# Altium schematic sheet Power_Supply.SchDoc: Power Supply
size A4; Author: Robin Geißler; CompanyName: Fraunhofer EMFT; DrawnBy: Robin Geißler; Revision: 1.0.; SheetNumber: 2; SheetTotal: 6
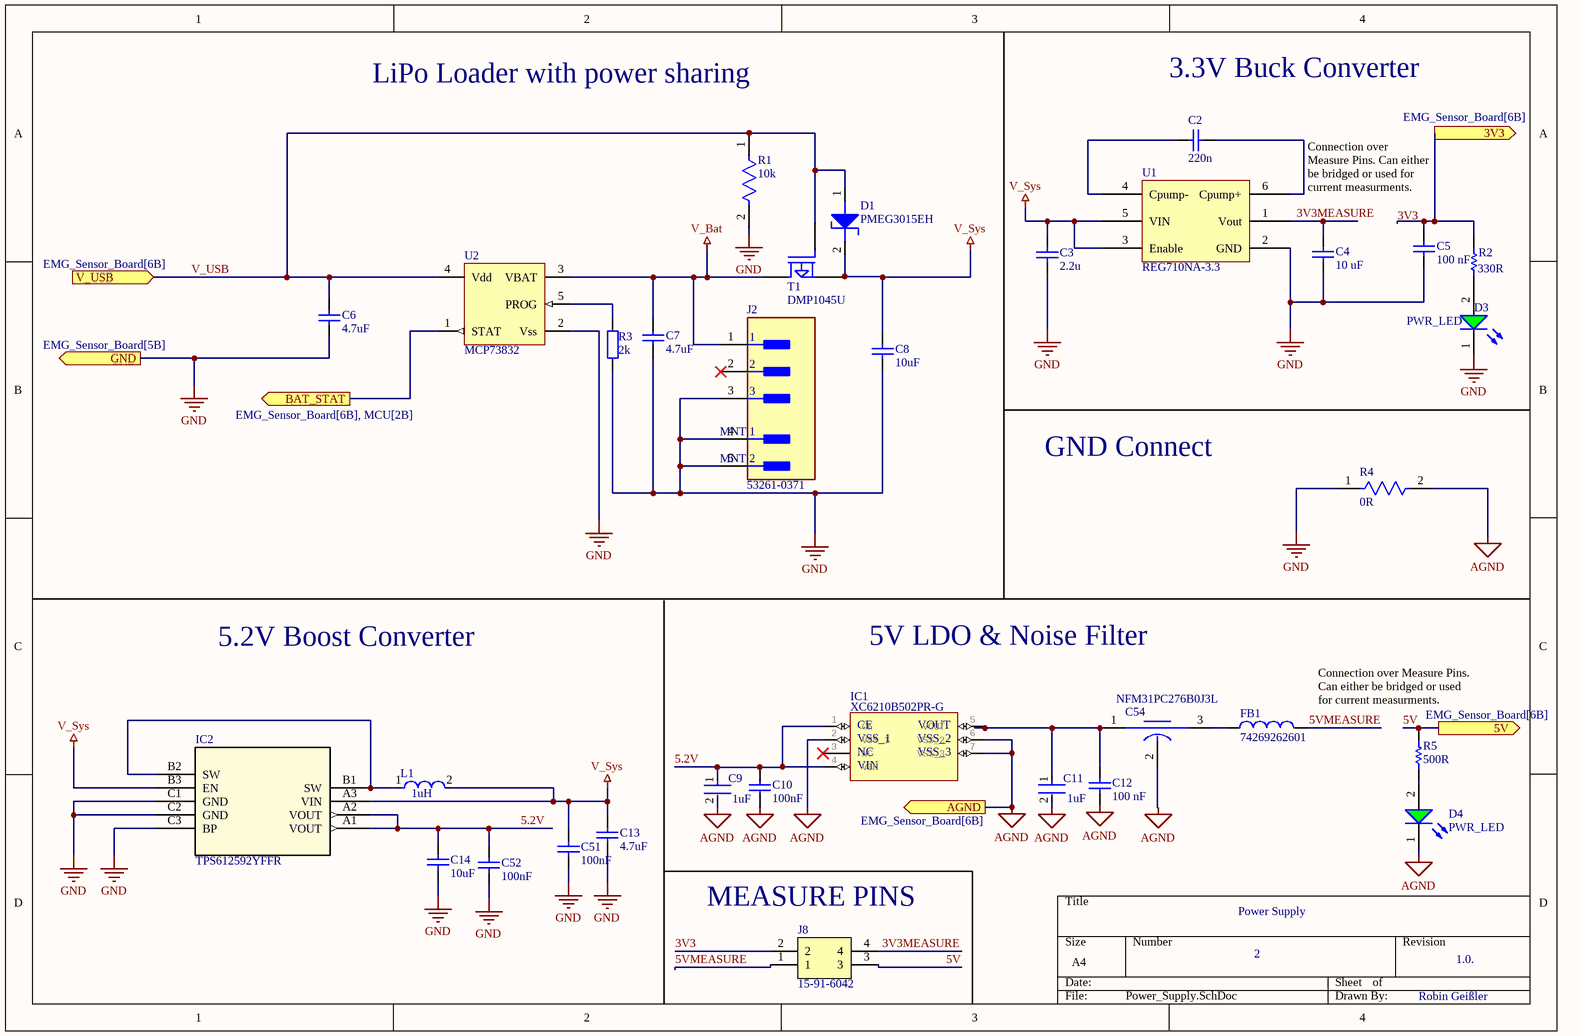
[diagram p0: Power_Supply.SchDoc]

## Parts
C2  220n  [C-1608 [0603]-N]
C3  2.2u  [C-1608 [0603]-N]
C4  10 uF  [C-1608 [0603]-N]
C5  100 nF  [C-1608 [0603]-N]
C6  4.7uF  [C-1608 [0603]-N]
C7  4.7uF  [C-1608 [0603]-N]
C8  10uF  [C-1608 [0603]-N]
C9  1uF  [FP-CGA3E-0_3-0_1-IPC_B]
C10  100nF  [C-1608 [0603]-N]
C11  1uF  [FP-CGA3E-0_3-0_1-MFG]
C12  100 nF  [C-1608 [0603]-N]
C13  4.7uF  [C-1608 [0603]-N]
C14  10uF  [C-1608 [0603]-N]
C51  100nF  [C-1608 [0603]-N]
C52  100nF  [C-1608 [0603]-N]
C54  NFM31PC276B0J3L  [FP-NFM31-0_2-MFG]
D1  PMEG3015EH  [SOD-123-D]
D3  PWR_LED  [WL-SMCW_0603_150060xx75000]
D4  PWR_LED  [WL-SMCW_0603_150060xx75000]
FB1  74269262601  [WE-TMSB_0603_HC]
IC1  XC6210B502PR-G  [XC6210B502PRG]
IC2  TPS612592YFFR  [DSBGA09_1P206X1P306_TEX]
J2  53261-0371  [FP-53261-0371-MFG]
J8  15-91-6042  [15916042]
L1  1uH  [FP-IHLP-1616BZ-FP_1_8545x-MFG]
R1  10k  [FP-RC0603-0_55-IPC_C]
R2  330R  [RESC1608X55X30LL15T15]
R3  2k  [C-1608 [0603]-N]
R4  0R  [FP-CRCW0603-e3-IPC_B]
R5  500R  [RESC1608X55X30NL15T15]
T1  DMP1045U  [SOT-23-3-PMOS]
U1  REG710NA-3.3  [SOT-23/6]
U2  MCP73832  [SOT95P280X145-5N]

## Ports
3V3 (out, see EMG_Sensor_Board[6B]), 5V (out, see EMG_Sensor_Board[6B]), AGND (out, see EMG_Sensor_Board[6B]), BAT_STAT (out, see EMG_Sensor_Board[6B], MCU[2B]), GND (out, see EMG_Sensor_Board[5B]), V_USB (in, see EMG_Sensor_Board[6B])

## Nets
AGND: C9.2 C10.2 C11.2 C12.2 C54.2(GND) D4.1(K) IC1.2(VSS_1) IC1.6(VSS_2) IC1.7(VSS_3) R4.2 ; port AGND
GND: C3.1 C4.1 C5.2 C6.1 C7.1 C8.1 C13.1 C14.1 C51.2 C52.2 D3.1(K) IC2.C1(GND) IC2.C2(GND) IC2.C3(BP) J2.3 J2.4(MNT_1) J2.5(MNT_2) R1.2 R3.1 R4.1 U1.2(GND) U2.2(Vss) ; port GND
V_Bat: C7.2 J2.1 T1.2(D) U2.3(VBAT)
V_Sys: C3.2 C8.2 C13.2 C51.1 D1.2 IC2.A3(VIN) IC2.B3(EN) L1.2 T1.3(S) U1.3(Enable) U1.5(VIN)
3V3: C5.1 J8.2 R2.2 ; port 3V3
3V3MEASURE: C4.2 J8.4 U1.1(Vout)
5.2V: C9.1 C10.1 C14.2 C52.1 IC1.1(CE) IC1.4(VIN) IC2.A1(VOUT) IC2.A2(VOUT)
5V: J8.3 R5.2 ; port 5V
5VMEASURE: FB1.2 J8.1
BAT_STAT: U2.1(STAT) ; port BAT_STAT
V_USB: C6.2 D1.1 R1.1 T1.1(G) U2.4(Vdd) ; port V_USB
NetC2_1: C2.1 U1.4(Cpump-)
NetC2_2: C2.2 U1.6(Cpump+)
NetC11_1: C11.1 C12.1 C54.1(Input) IC1.5(VOUT)
NetC54_3: C54.3(Output) FB1.1
NetD3_2: D3.2(A) R2.1
NetD4_2: D4.2(A) R5.1
NetIC2_B1: IC2.B1(SW) IC2.B2(SW) L1.1
NetR3_2: R3.2 U2.5(PROG)

Not connected (* = marked no-connect by the designer): IC1 3(NC)*; J2 2*

## Notes on the sheet
- LiPo Loader with power sharing
- 3.3V Buck Converter
- Connection over Measure Pins. Can either be bridged or used for current measurments.
- GND Connect
- 5.2V Boost Converter
- 5V LDO & Noise Filter
- (near J8) MEASURE PINS

## Library data of the parts
C2 = C220n_0603_CGA3E3X7R1H224K080AB: CAP 0603 50V 0.22uF X7R 10% AEC-Q200; Supplier 1: Mouser; Supplier Part Number 1: 810-CGA3E3X7R1H224K
C3 = C2u2_0603_GRM188R61E225KA12D: CAP 0603 2.2uF 25volts X5R 10%; Supplier 1: Mouser; Supplier Part Number 1: 81-GRM188R61E225KA2D
C4 C8 C14 = C10u_0603_GRM188R61E106KA73J: CAP CER 10UF 25V X5R 0603 10%; Supplier 1: Mouser; Supplier Part Number 1: 81-GRM188R61E106KA3J
C5 C12 = C100n_0603_C0603C104J4RAC: Multilayer Ceramic Capacitors MLCC - SMD/SMT 16volts 0.1uF 5% X7R; Manufacturer: KEMET; Capacitance: 100nF; Voltage Rating: 16V; Dissipation Factor: 3.5%; Supplier 1: Mouser; Supplier Part Number 1: 80-C0603C104J4RAC; Manufacturer Part Number: C0603C104J4RAC; Description 1: Multilayer Ceramic Capacitors MLCC - SMD/SMT 16volts 0.1uF 5% X7R; Stock 1: 0; Pricing 1: 1=0.14, 10=0.055, 50=0.055, 100=0.038, 1000=0.026, 10000=0.018 (USD); Case/Package: 0603; Case Code (Imperial): 0603; Case Code (Metric): 1608; Dielectric Material: Ceramic; Min Operating Temperature: -55°C; Max Operating Temperature: 125°C; Tolerance: 5%; Packaging: Tape and Reel; Dielectric: X7R; Termination: SMD/SMT; Package Quantity: 4000; Voltage Rating (DC): 16V; Length: 1.6mm; Height: 0.8mm; Width: 0.8mm
C6 C7 C13 = C4u7_0603_C1608X5R1C475K080AE: CAP CER 0603 16V 4.70uF X5R 10%; Supplier 1: Mouser; Supplier Part Number 1: 810-C1608X5R1C475KE
C9 C11 = CMP-08246-002551-1: Cap Ceramic 1uF 35V X7R 10% Pad SMD 0603 +125°C Automotive T/R; Termination: SMD/SMT; Packaging: Tape and Reel; Capacitance: 1uF; Tolerance: 10%; Mount: Surface Mount; Thickness: 0.035inch; Case Code (Imperial): 0603; Voltage Rating: 35V; Case/Package: 0603; Case Code (Metric): 1608; Dielectric: X7R; Width: 0.031inch; Length: 0.063inch; Min Operating Temperature: -55°C; Weight: 7.1E-05oz; Max Operating Temperature: 125°C; Voltage Rating (DC): 35V; Height: 0.8mm; Ratings: AEC-Q200; Package Quantity: 4000
C10 C51 C52 = C100n_0603_C0603C104J4RAC: Multilayer Ceramic Capacitors MLCC - SMD/SMT 16volts 0.1uF 5% X7R; Manufacturer: KEMET; Voltage Rating: 16V; Dissipation Factor: 3.5%; Supplier 1: Mouser; Supplier Part Number 1: 80-C0603C104J4RAC; Manufacturer Part Number: C0603C104J4RAC; Description 1: Multilayer Ceramic Capacitors MLCC - SMD/SMT 16volts 0.1uF 5% X7R; Stock 1: 0; Pricing 1: 1=0.14, 10=0.055, 50=0.055, 100=0.038, 1000=0.026, 10000=0.018 (USD); Case/Package: 0603; Case Code (Imperial): 0603; Case Code (Metric): 1608; Dielectric Material: Ceramic; Min Operating Temperature: -55°C; Max Operating Temperature: 125°C; Capacitance: 100nF; Tolerance: 5%; Packaging: Tape and Reel; Dielectric: X7R; Termination: SMD/SMT; Package Quantity: 4000; Voltage Rating (DC): 16V; Length: 1.6mm; Height: 0.8mm; Width: 0.8mm
C54 = CMP-2000-06846-2: Large Current 3 Terminals Low ESL Chip Multilayer Ceramic Capacitors for General Purpose, 1206, 27uF, 20%, 6.3V; Max Current Rating: 6A; DC Resistance (DCR): 5mR; Insulation Resistance: 20MR; Radiation Hardening: No; Height: 1.3mm; Lead Free: Lead Free; Voltage: 6.3V; Termination: Flat; Mount: Surface Mount; Case/Package: 1206; Capacitance: 27uF; Case Code (Imperial): 1206; Max Voltage Rating (DC): 6.3V; Min Operating Temperature: -40°C; Max Operating Temperature: 85°C; Package Quantity: 1; Length: 3.2mm; Tolerance: 20%; Case Code (Metric): 3216; Packaging: Tape and Reel; Voltage Rating (DC): 6.3V; REACH SVHC: No SVHC; Current Rating: 6A; Width: 1.6mm; Depth: 1.6mm; Current: 6A
D3 D4 = CMP-1426-00002-3: NexarPartId: 29687084; Color: Green; Power Dissipation: 105mW; Peak Wavelength: 515nm; Viewing Angle: 140°; Test Current: 20mA; Wavelength: 520nm; Lens Style: Clear, Rectangular; Max Junction Temperature (Tj): 95°C; Luminous Intensity: 430mcd; Output Current: 10µA; Max Reverse Voltage (DC): 5V; Forward Voltage: 3.2V; Dominant Wavelength: 525nm; Forward Current: 100mA; Mount: Surface Mount; Height: 700µm; Lead Free: Lead Free; Min Operating Temperature: -40°C; Max Operating Temperature: 85°C; Length: 1.6mm; Width: 800µm; Case/Package: 0603; Case Code (Imperial): 0603; Case Code (Metric): 1608; Packaging: Tape and Reel; Reverse Voltage: 5V; REACH SVHC: Unknown; RoHS: Compliant
FB1 = CMP-03913-130924275-1: 74269262601 Ferrite Bead, Suppression, 600 Ohm, 1.5A Rohs Compliant: Yes; DC Resistance (DCR): 90mΩ; NexarPartId: 130924275; Length: 1.6mm; Width: 800µm; Min Operating Temperature: -55°C; Current Rating: 1.5A; RoHS: Compliant; Max Operating Temperature: 125°C; Height: 800µm
IC1 = XC6210B502PR-G: LDO Voltage Regulators 700mA High Speed LDO Regulator   Source:  Datasheet; Manufacturer_Name: Torex; GateName_1: G$1; SymbolName_1: XC6210B502PR-G; LibraryName: XC6210B502PR-G; DeviceSetName: XC6210B502PR-G; Package: XC6210B502PRG; Mouser_Part_Number: 865-XC6210B502PR-G; Mouser_Price-Stock: https://www.mouser.co.uk/ProductDetail/Torex-Semiconductor/XC6210B502PR-G?qs=AsjdqWjXhJ8XXo5wZ7cEHQ%3D%3D; Manufacturer_Part_Number: XC6210B502PR-G; Height: 1.6mm
IC2 = TPS612592YFFR: No Description Available; Mfr_Name: Texas Instruments; Copyright: Copyright (C) 2024 Ultra Librarian. All rights reserved.; Manufacturer_Part_Number: TPS612592YFFR; RefDes: RefDes; Type: DEV
J2 = CMP-04776-000071-1: CONN HEADER SMD R/A 3POS 1.25MM; Manufacturer: Molex; Number Of Contacts: 3; Conn Orientation: Right Angle; Current Rating: 1A; Voltage Rating: 125V; Conn Gender: Male; Category: Conn; Automotive: No; Footprint Url: https://www.molex.com/pdm_docs/sd/532610371_sd.pdf; Height: 3.6mm; Number Of Rows: 1; Temperature Range Low: -40°C; Package: 0; Octopart: https://octopart.com/53261-0371-molex-655314; ComponentLink2Description: Datasheet; Lead Free: Yes; Ambient Temperature Range Low: -40°C; Device Class L3: unset; Mouser Description: 1.25mm (.049") Pitch PicoBlade Header, Surface Mount, Right Angle, Lead-free, 3 Circuits; Digikey Description: CONN HEADER SMD R/A 3POS 1.25MM; Device Class L2: Headers and Wire Housings; Contact Material: Tin,Nickel; Manufacturer Part Number: 53261-0371; Ambient Temperature Range High: +105°C; ComponentLink2URL: https://www.molex.com/webdocs/datasheets/pdf/en-us/0532610371_PCB_HEADERS.pdf; Pitch: 1.25mm; Temperature: -40°C to +105°C; RoHS: TRUE; Device Class L1: Connectors; Temperature Range High: +105°C
J8 = 15-91-6042: 2.54mm Pitch SL Wire-to-Board Header, Low Profile, Surface Mount, Single Row, Right-Angle, 3.05mm Pocket, Shrouded, with Press-fit Plastic Peg,  Circuits, Tin (Sn) Plating, Embossed Tape Packaging; Manufacturer_Name: Molex; Geometry.Height: 11.69mm; Manufacturer_Part_Number: 15-91-6042; Mouser Part Number: 538-15-91-6042; Mouser Price/Stock: https://www.mouser.co.uk/ProductDetail/Molex/15-91-6042?qs=3DzawVMofg8HeBuyct9LCA%3D%3D; Arrow Part Number: *; Arrow Price/Stock: *; Datasheet Link: https://componentsearchengine.com/Datasheets/1/15-91-6042.pdf
L1 = CMP-02424-000048-1: Fixed Inductors Automotive High Saturation Series SMT 1uH 3.75A 37mΩ 20%; DC Resistance (DCR): 37mR; Test Frequency: 100kHz; Self Resonant Frequency: 90MHz; Connector Type: Power; Shielding: Shielded; Lead Free: Lead Free; Length: 4.45mm; Min Operating Temperature: -55°C; Case/Package: 1616; Radiation Hardening: No; Height: 2mm; Inductance: 1uH; Packaging: Tape and Reel; Termination: SMD/SMT; Max DC Current: 3.75A; Package Quantity: 4000; Depth: 4.31mm; Width: 4.06mm; Tolerance: 20%; Max Operating Temperature: 125°C; Military Standard: Not
R1 = CMP-2100-03664-2: RES 10K OHM 1% 1/10W 0603; Voltage Rating: 75V; Voltage Rating (DC): 50V; Resistance: 10kR; Power Rating: 100mW; Temperature Coefficient: 100ppm/°C; Depth: 0.8mm; Termination: SMD/SMT; Resistor Type: Thick Film; Series: RC; Construction: Rectangular; Features: Moisture Resistant; Packaging: Tape and Reel; Min Operating Temperature: -55°C; Number of Terminations: 2; Lead Pitch: 0.3mm; RoHS Compliant: Yes; Case/Package: 0603; Resistance Tolerance: 1%; Military Standard: Not; Weight: 7.1E-05oz; Number of Pins: 2; Tolerance: 1%; Length: 1.6mm; Case Code (Imperial): 0603; Lead Free: Lead Free; Width: 0.8mm; Max Power Dissipation: 100mW; Height: 0.45mm; Max Operating Temperature: 155°C; Case Code (Metric): 1608; Size Code: 0603
R2 = CMP-2000-00435-2: Chip Resistor, 330 Ohm, +/- 1%, 0.1 W, -55 to 155 degC, 0603 (1608 Metric), RoHS, Tape and Reel; Gender: Male; Mating Cycles: 10000; Current Rating: 500 mA; Voltage Rating: 10 V; REACH SVHC: No SVHC; PackageDescription: 2-Pin Surface Mount Device, Body 1.6 x 0.85 mm; Contact Finish: Gold; Pins: 8; ComponentLink1Description: Manufacturer URL; Packaging: Tape and Reel; Max Operating Temperature: 85 degC; Contact Material: Copper; Height: 1.45 mm; Width: 1.45 mm; DatasheetVersion: Apr-15; Package Quantity: 1500; Contact Plating: Gold; PackageReference: 0603; Mount: Surface Mount; Lead Pitch: 1.1 mm; Min Operating Temperature: -25 degC; ComponentLink1URL: http://www.panasonic.com/; ComponentLink2URL: http://industrial.panasonic.com/cdbs/www-data/pdf/RDA0000/AOA0000C86.pdf; Length: 13.7 mm; ComponentLink2Description: Datasheet; RoHSCompliant: true
R3 = R2k_0603_ERA-3AEB202V: PANASONIC ELECTRONIC COMPONENTS         ERA3AEB202V             SMD Chip Resistor, Thin Film, 2 kohm, 75 V, 0603 [1608 Metric], 100 mW,  0.1%, ERA Series; Resistance: 2kR; Temperature Coefficient: 25ppm/°C; Voltage Rating: 75V; Power Rating: 100mW; Supplier 1: Farnell; Supplier Part Number 1: 1811500RL; Manufacturer: Panasonic; Manufacturer Part Number: ERA-3AEB202V; Description 1: PANASONIC ELECTRONIC COMPONENTS         ERA3AEB202V             SMD Chip Resistor, Thin Film, 2 kohm, 75 V, 0603 [1608 Metric], 100 mW,  0.1%, ERA Series; Stock 1: 0; Mount: Surface Mount; Case/Package: 0603; Number of Pins: 2; Contact Plating: Tin; Case Code (Metric): 1608; Case Code (Imperial): 0603; Min Operating Temperature: -55°C; Max Operating Temperature: 155°C; Tolerance: 0.1%; Composition: Thin Film; Packaging: Tape and Reel; Package Quantity: 5000; Termination: SMD/SMT; Number of Terminations: 2; Military Standard: Not; Max Power Dissipation: 100mW; Voltage Rating (DC): 75V; Working Voltage: 75V; Length: 1.6mm; Height: 0.45mm; Width: 0.8mm; Depth: 0.8mm; Radiation Hardening: No; REACH SVHC: No SVHC; Lead Free: Lead Free; ComponentLink1URL: http://www.farnell.com/datasheets/2052875.pdf; ComponentLink1Description: http://www.farnell.com/datasheets/2052875.pdf; ComponentLink2URL: http://www.farnell.com/datasheets/1776116.pdf; ComponentLink2Description: http://www.farnell.com/datasheets/1776116.pdf; ComponentLink3URL: http://www.farnell.com/datasheets/2059650.pdf; ComponentLink3Description: http://www.farnell.com/datasheets/2059650.pdf; ComponentLink4URL: http://www.alliedelec.com/m/d/b6b0537e86f421aa7f5975bb1d8f429a.pdf; ComponentLink4Description: http://www.alliedelec.com/m/d/b6b0537e86f421aa7f5975bb1d8f429a.pdf; ComponentLink5URL: http://www.farnell.com/datasheets/485442.pdf; ComponentLink5Description: http://www.farnell.com/datasheets/485442.pdf; ComponentLink6URL: https://www.distrelec.biz/Web/Downloads/_t/ds/ERA_eng_tds.pdf?mime=application%2Fpdf; ComponentLink6Description: https://www.distrelec.biz/Web/Downloads/_t/ds/ERA_eng_tds.pdf?mime=application%2Fpdf; ComponentLink7URL: http://industrial.panasonic.com/www-data/pdf/AOA0000/AOA0000CE26.pdf; ComponentLink7Description: http://industrial.panasonic.com/www-data/pdf/AOA0000/AOA0000CE26.pdf; ComponentLink8URL: http://www.produktinfo.conrad.com/datenblaetter/450000-474999/450879-da-01-en-WIDERSTAND_0603_ERA.pdf; ComponentLink8Description: http://www.produktinfo.conrad.com/datenblaetter/450000-474999/450879-da-01-en-WIDERSTAND_0603_ERA.pdf
R4 = CMP-2000-03818-2: RES Thick Film, 0Ω, 0.1W, 0603; Resistance: 0mR; Power Rating: 100mW; Voltage Rating (DC): 75V; Temperature Coefficient: 100ppm/°C; Tolerance: 1%; Height: 0.45mm; Features: Automotive AEC-Q200; Number of Terminations: 2; Termination: SMD/SMT; Military Standard: Not; Case/Package: 0603; Max Operating Temperature: 155°C; Width: 0.033inch; Composition: Thick Film; Contact Plating: Tin; Length: 1.55mm; Max Power Dissipation: 100mW; Number of Pins: 2; Weight: 7.1E-05oz; Depth: 0.85mm; Radiation Hardening: No; Lead Free: Lead Free; Voltage Rating: 75V; Packaging: Tape and Reel; Package Quantity: 10000; Min Operating Temperature: -55°C; Case Code (Metric): 1608; Case Code (Imperial): 0603
R5 = CMP-2000-00539-1: Manufacturer: Panasonic; Part Number: ERJ3EKF5100V
T1 = MOSFET P: Mouser-Nr.:621-DMP1045U-7; Supplier Part Number 1: 621-DMP1045U-7; Supplier 1: Mouser
U1 = U_SOT23-6_REG710NA-3.3: Schaltspannungsregler 30-mA Switched-Cap DC-DC Converter, Buck-Boost, Vout = 3.3V; Supplier 1: Mouser; Supplier Part Number 1: 595-REG710NA-3.3/3K
U2 = MCP73832: Supplier 1: Mouser; Supplier Part Number 1: 579-MCP73832T-2ACIOT